# EasyEDA Pro project ProPrj_CGM_BH66F2452_HT32F67595_V1.0.epro

# Schematic CGM_BH66F2452_HT32F67595
Board Name: Board1; Create Date: 2025-03-17; Page Name: P1; Project Name: CGM_BH66F2452_HT32F67595; Schematic Name: CGM_BH66F2452_HT32F67595; Update Date: 2025-05-27; Company: BestHealth; Drawed: viking; Page Size: A4; Version: V1.0
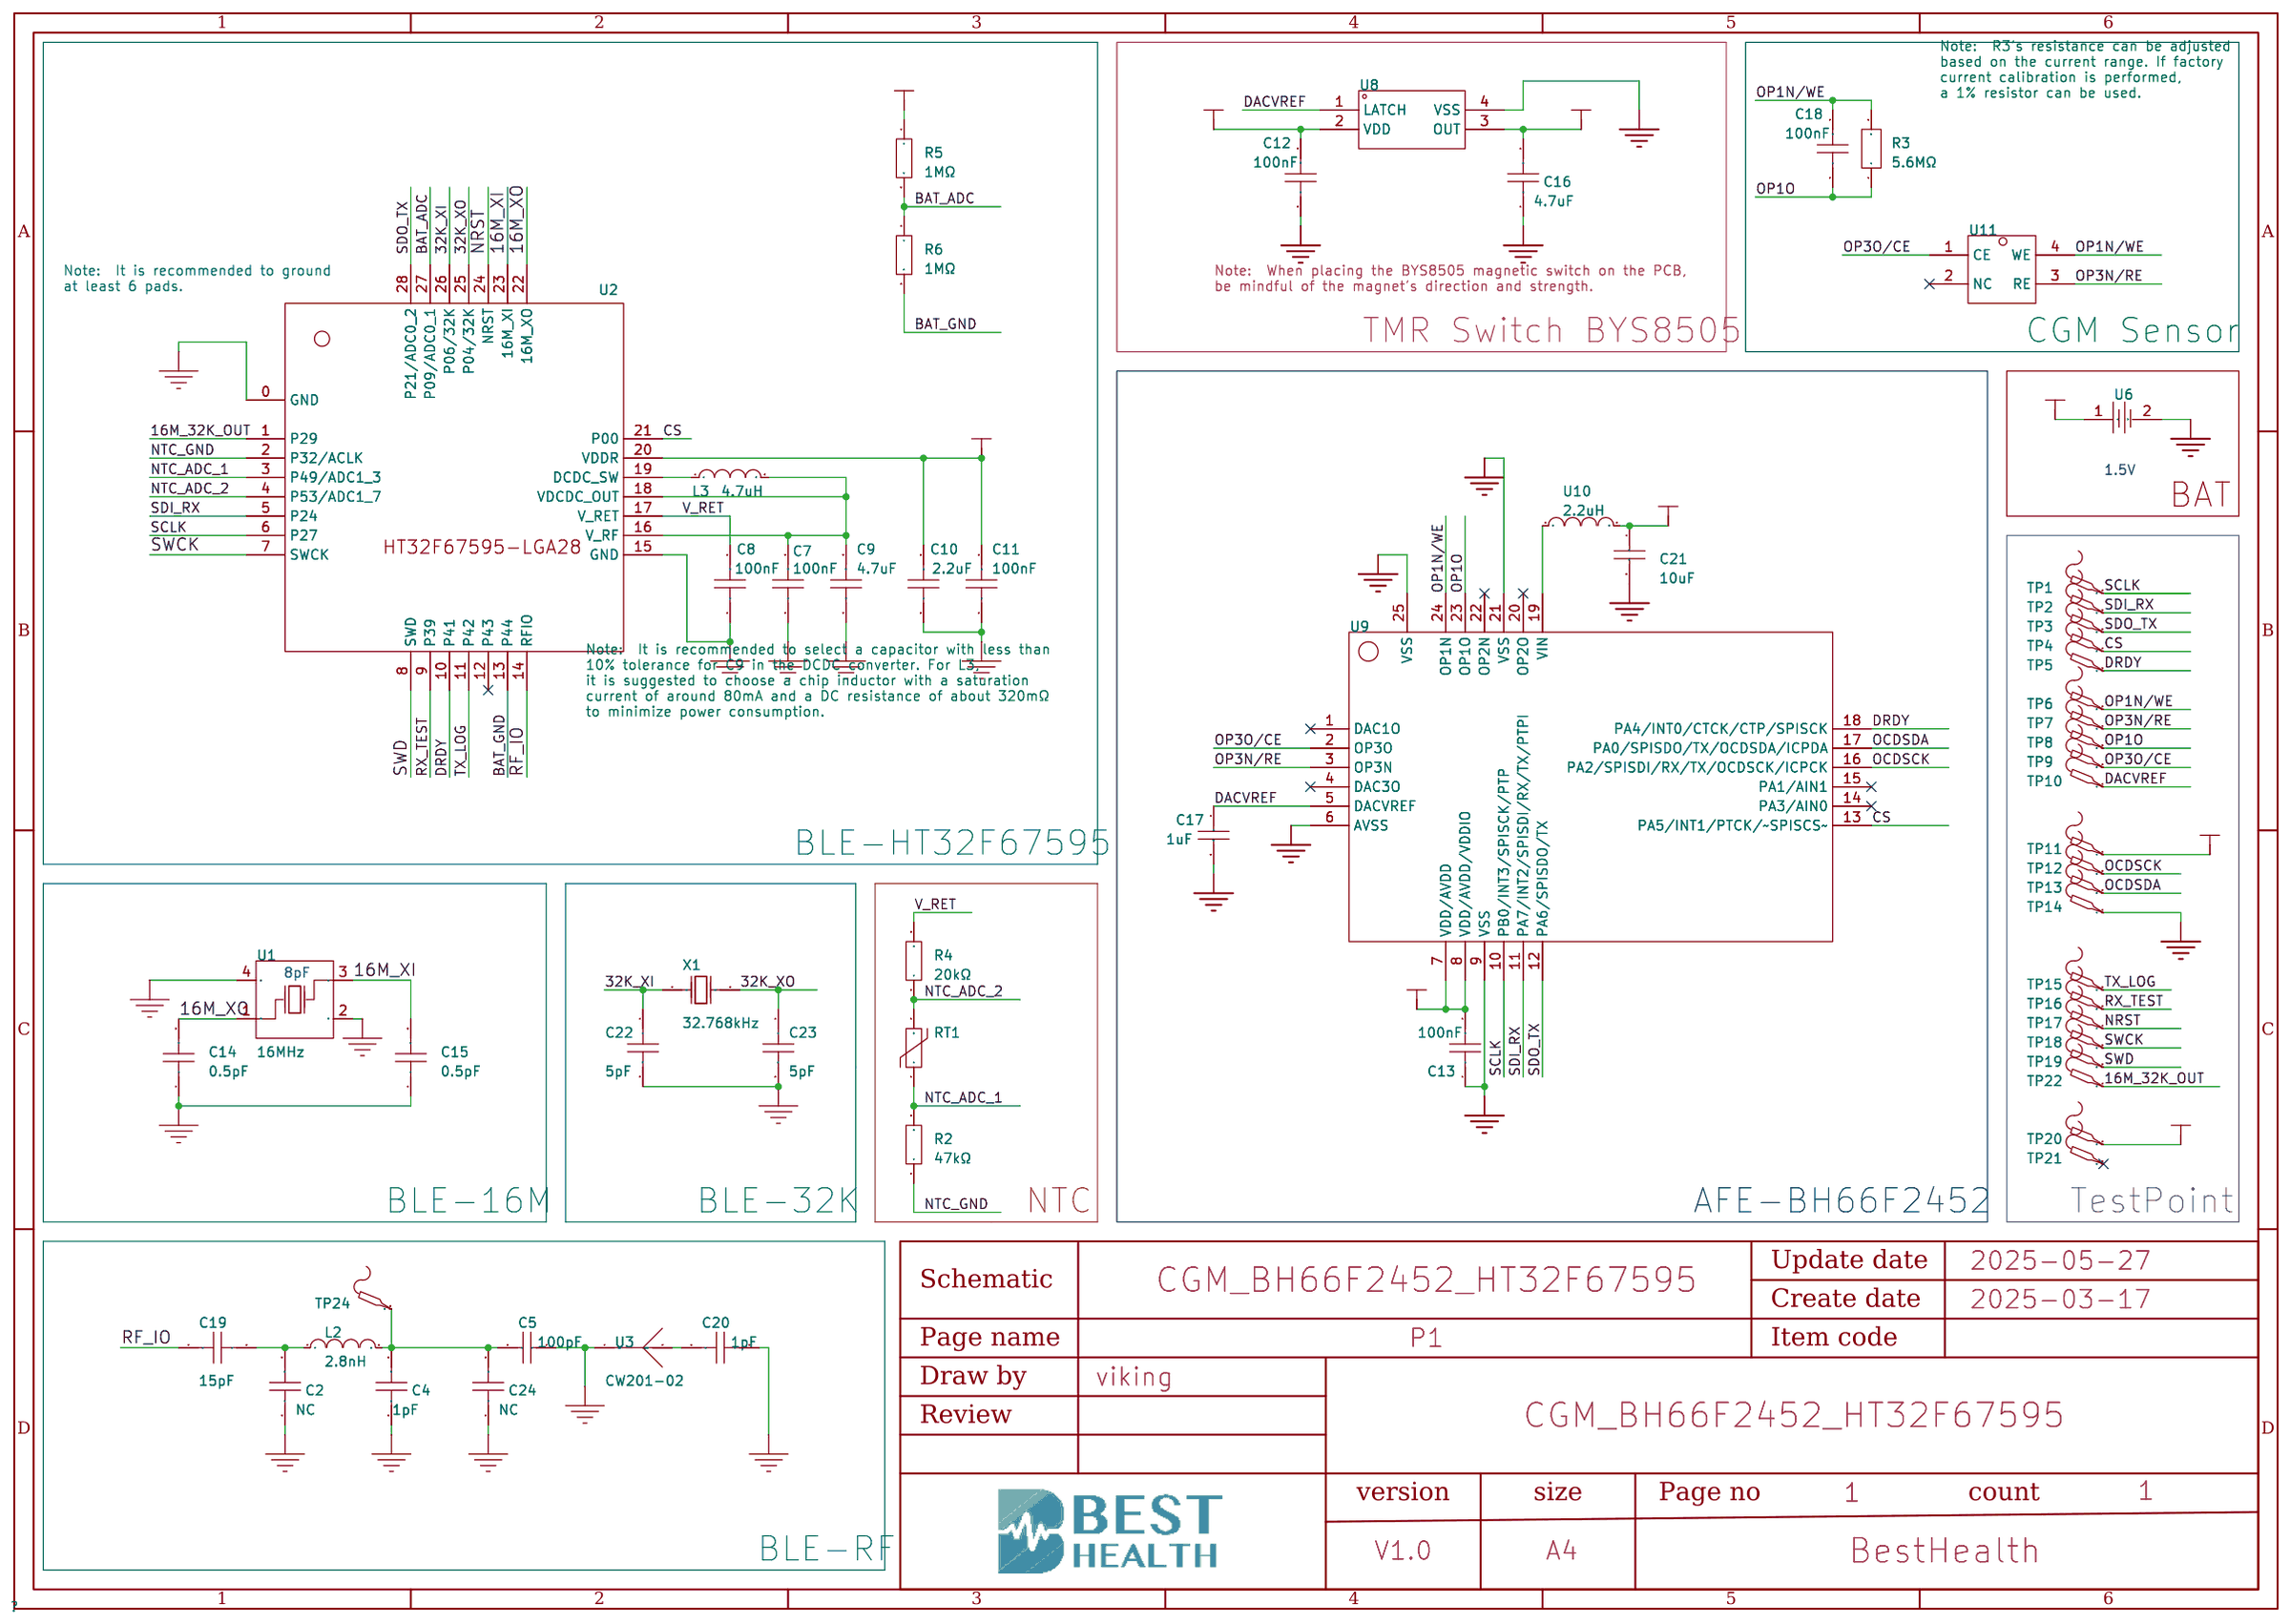
[diagram p0: schematic sheet]

## Parts
C2  1.2pF  [C0201]
C4  1pF  [C0201]
C5  100pF  [C0201]
C7  100nF  [C0201]
C8  100nF  [C0201]
C9  4.7uF  [C0402]
C10  2.2uF  [C0201]
C11  100nF  [C0201]
C12  100nF  [C0201]
C13  100nF  [C0201]
C14  0.5pF  [C0201]  (no BOM)
C15  0.5pF  [C0201]  (no BOM)
C16  4.7uF  [C0201]
C17  1uF  [C0201]
C18  100nF  [C0201]
C19  15pF  [C0201]
C20  1pF  [C0201]
C21  10uF  [C0402]
C22  5pF  [C0201]  (no BOM)
C23  5pF  [C0201]  (no BOM)
C24  1.2pF  [C0201]
L2  2.8nH  [L0201-RD]
L3  4.7uH  [L0603]
R2  47kΩ  [R0201]
R3  5.6MΩ  [R0402]
R4  20kΩ  [R0201]
R5  1MΩ  [R0201]
R6  1MΩ  [R0201]
RT1  NTCG064BF473FTBX  [R0201]
TP1  TP1  [TESTPOINT_1]  (no BOM)
TP2  TP1  [TESTPOINT_1]  (no BOM)
TP3  TP1  [TESTPOINT_1]  (no BOM)
TP4  TP1  [TESTPOINT_1]  (no BOM)
TP5  TP1  [TESTPOINT_1]  (no BOM)
TP6  TP1  [TESTPOINT_1]  (no BOM)
TP7  TP1  [TESTPOINT_1]  (no BOM)
TP8  TP1  [TESTPOINT_1]  (no BOM)
TP9  TP1  [TESTPOINT_1]  (no BOM)
TP10  TP1  [TESTPOINT_1]  (no BOM)
TP11  TP1  [TESTPOINT_1]  (no BOM)
TP12  TP1  [TESTPOINT_1]  (no BOM)
TP13  TP1  [TESTPOINT_1]  (no BOM)
TP14  TP1  [TESTPOINT_1]  (no BOM)
TP15  -  [TESTPOINT_1]  (no BOM)
TP16  -  [TESTPOINT_1]  (no BOM)
TP17  -  [TESTPOINT_1]  (no BOM)
TP18  -  [TESTPOINT_1]  (no BOM)
TP19  -  [TESTPOINT_1]  (no BOM)
TP20  -  [TESTPOINT_1]  (no BOM)
TP21  -  [TESTPOINT_1]  (no BOM)
TP22  -  [TESTPOINT_1]  (no BOM)
TP24  -  [TESTPOINT_1]  (no BOM)
U1  16MHz  [CRYSTAL-SMD_4P-L2.0-W1.6-BL-A]
U2  HT32F67595_LGA28  [LGA28_L3.0_W3.0mm]
U3  CW201-02  [ANT-SMD_L2.0-W1.2_CW201]
U6  -  [SR716]
U8  -  [LGA-4_L1.5-W1.5-P0.65-BL]
U9  -  [WQFN-24_L3.0-W3.0-P0.40-TL-EP1.9]
U10  2.2uH  [IND-SMD_L2.0-W1.6]
U11  -  [CGM_Sener_V2_TBJ]
X1  32.768kHz  [CRYSTAL-SMD_L1.7-W1.1]

## Library data of the parts
C2 C24 = GJM0335C1H1R2WB01D: 容值:1.2pF;额定电压:50V;材质(温度系数):C0G;; LCSC Part Name: 1.2pF 50V; Supplier Part: C1864231; Manufacturer: muRata(村田); Supplier Footprint: 0201; JLCPCB Part Class: 扩展库; Datasheet: https://atta.szlcsc.com/upload/public/pdf/source/20210503/69FEFD345367A6ED6565135E0189A381.pdf; Supplier: LCSC; Voltage Rated: 50V; Temperature Coefficient: C0G
C4 C20 = GRM0335C1H1R0BA01D: 容值:1pF;精度:-;额定电压:50V;材质(温度系数):C0G;; LCSC Part Name: 1pF 50V; Supplier Part: C85893; Manufacturer: muRata(村田); Supplier Footprint: 0201; JLCPCB Part Class: 扩展库; Datasheet: https://atta.szlcsc.com/upload/public/pdf/source/20200305/C490387_23319AE8C154DEB24C505E6C82A8106A.pdf; Supplier: LCSC; Voltage Rated: 50V; Temperature Coefficient: C0G
C5 = GRM0335C1H101JA01D: 容值:100pF;精度:±5%;额定电压:50V;材质(温度系数):C0G;; LCSC Part Name: 100pF ±5% 50V; Supplier Part: C76922; Manufacturer: muRata(村田); Supplier Footprint: 0201; JLCPCB Part Class: 扩展库; Datasheet: https://atta.szlcsc.com/upload/public/pdf/source/20180307/C76922_15204090884891407712.pdf; Supplier: LCSC; Tolerance: ±5%; Voltage Rated: 50V; Temperature Coefficient: C0G
C7 C8 C11-C13 C18 = CL03A104KO3NNNC: 容值:100nF;精度:±10%;额定电压:16V;材质(温度系数):X5R;; LCSC Part Name: 100nF ±10% 16V; Supplier Part: C307380; Manufacturer: SAMSUNG(三星); Supplier Footprint: 0201; JLCPCB Part Class: 扩展库; Datasheet: https://atta.szlcsc.com/upload/public/pdf/source/20181009/C307380_E0679AAF9658ADA26DBF30CED0CA6925.pdf; Supplier: LCSC; Tolerance: ±10%; Voltage Rated: 16V; Temperature Coefficient: X5R
C9 = CL05A475KP5NRNC: 容值:4.7uF;精度:±10%;额定电压:10V;材质(温度系数):X5R;; LCSC Part Name: 4.7uF±10%10V; Supplier Part: C368809; Manufacturer: SAMSUNG(三星); Supplier Footprint: 0402; JLCPCB Part Class: ExtendedPart; Datasheet: https://atta.szlcsc.com/upload/public/pdf/source/20190214/C368809_F5BC89A17870A6A4D09EEE17ED063906.pdf; Supplier: LCSC; Tolerance: ±10%; Voltage Rated: 10V; Temperature Coefficient: X5R
C10 = GRM033R61A225ME47D: 容值:2.2uF;精度:±20%;额定电压:10V;材质(温度系数):X5R;; LCSC Part Name: 2.2uF ±20% 10V; Supplier Part: C319184; Manufacturer: muRata(村田); Supplier Footprint: 0201; JLCPCB Part Class: 扩展库; Datasheet: https://atta.szlcsc.com/upload/public/pdf/source/20181029/C319184_E8D08B09A5B8275146DCCD460C2C3E2F.pdf; Supplier: LCSC; Tolerance: ±20%; Voltage Rated: 10V; Temperature Coefficient: X5R
C14 C15 = GRM0335C1HR50BA01D: 容值:0.5pF;额定电压:50V;温度系数:C0G;; LCSC Part Name: ±0.1pF 0.5pF 50V; Supplier Part: C85920; Manufacturer: muRata(村田); Supplier Footprint: 0201; Datasheet: https://atta.szlcsc.com/upload/public/pdf/source/20200305/C490387_23319AE8C154DEB24C505E6C82A8106A.pdf; Supplier: LCSC; Voltage Rating: 50V; Temperature Coefficient: C0G
C16 = GRM035R60J475ME15D: 容值:4.7uF;精度:±20%;额定电压:6.3V;材质(温度系数):X5R;; LCSC Part Name: 4.7uF ±20% 6.3V; Supplier Part: C335103; Manufacturer: muRata(村田); Supplier Footprint: 0201; JLCPCB Part Class: 扩展库; Datasheet: https://atta.szlcsc.com/upload/public/pdf/source/20181123/C335103_65BC12EC0C1BBB7D605A3646AEC2CDDD.pdf; Supplier: LCSC; Tolerance: ±20%; Voltage Rated: 6.3V; Temperature Coefficient: X5R
C17 = CL03A105MQ3CSNH: 容值:1uF;精度:±20%;额定电压:6.3V;材质(温度系数):X5R;; LCSC Part Name: 1uF ±20% 6.3V; Supplier Part: C53067; Manufacturer: SAMSUNG(三星); Supplier Footprint: 0201; JLCPCB Part Class: 扩展库; Datasheet: https://atta.szlcsc.com/upload/public/pdf/source/20160218/1457707763339.pdf; Supplier: LCSC; Tolerance: ±20%; Voltage Rated: 6.3V; Temperature Coefficient: X5R
C19 = GRM0335C1H150JA01D: 容值:15pF;精度:±5%;额定电压:50V;温度系数:C0G;; LCSC Part Name: 15pF ±5% 50V; Supplier Part: C85891; Manufacturer: muRata(村田); Supplier Footprint: 0201; JLCPCB Part Class: 扩展库; Datasheet: https://atta.szlcsc.com/upload/public/pdf/source/20200305/C490387_23319AE8C154DEB24C505E6C82A8106A.pdf; Supplier: LCSC; Tolerance: ±5%; Voltage Rating: 50V; Temperature Coefficient: C0G
C21 = CL05A106MQ5NUNC: 容值:10uF;精度:±20%;额定电压:6.3V;材质(温度系数):X5R;; LCSC Part Name: 10uF ±20% 6.3V; Supplier Part: C15525; Manufacturer: SAMSUNG(三星); Supplier Footprint: 0402; JLCPCB Part Class: 基础库; Datasheet: https://atta.szlcsc.com/upload/public/pdf/source/20220823/2B02EE04F8F211D38A52DCB16EB6BEBA.pdf; Supplier: LCSC; Tolerance: ±20%; Voltage Rated: 6.3V; Temperature Coefficient: X5R
C22 C23 = GJM0335C1E5R0BB01D: 容值:5pF;额定电压:25V;材质(温度系数):C0G;; LCSC Part Name: 5pF 25V; Supplier Part: C464954; Manufacturer: muRata(村田); Supplier Footprint: 0201; JLCPCB Part Class: 扩展库; Datasheet: https://atta.szlcsc.com/upload/public/pdf/source/20191129/C464954_5BF7E89BC2BFACC5C6B733268D26AC03.pdf; Supplier: LCSC; Voltage Rated: 25V; Temperature Coefficient: C0G
L2 = LQP03TG2N8B02D: 电感值:2.8nH;精度:-;额定电流:450mA;饱和电流(Isat):-;直流电阻(DCR):250mΩ;; Supplier Part: C237463; Manufacturer: muRata(村田); Supplier Footprint: 0201; Datasheet: https://atta.szlcsc.com/upload/public/pdf/source/20181120/C333991_3B037B5A0300CC3F313E5A09B9D1E037.pdf; Supplier: LCSC; Rated Current: 450mA; DC Resistance (DCR): 250mΩ; Q @ Freq: 13@500MHz; Frequency - Self Resonant: 6GHz; Type: 厚膜电感
L3 = MLZ1608N4R7LT000: 电感值:4.7uH;精度:±20%;额定电流:-;饱和电流(Isat):80mA;直流电阻(DCR):320mΩ;; LCSC Part Name: 4.7uH ±20% 80mA; Supplier Part: C383396; Manufacturer: TDK; Supplier Footprint: 0603; JLCPCB Part Class: 扩展库; Datasheet: https://atta.szlcsc.com/upload/public/pdf/source/20200619/C383390_12B08DE970320BE328D08C37492510E7.pdf; Supplier: LCSC; Tolerance: ±20%; Saturation Current (Isat): 80mA; DC Resistance (DCR): 320mΩ; Frequency - Self Resonant: 80MHz
R2 = RC0201FR-0747KL: 电阻类型:厚膜电阻;阻值:47kΩ;精度:±1%;功率:50mW;温度系数:±200ppm/℃;最大工作电压:25V;工作温度范围:-55℃~+155℃;; LCSC Part Name: 47kΩ ±1% 50mW; Supplier Part: C138139; Manufacturer: YAGEO(国巨); Supplier Footprint: 0201; JLCPCB Part Class: 扩展库; Datasheet: https://atta.szlcsc.com/upload/public/pdf/source/20171107/C138139_15100517155931097035.pdf; Supplier: LCSC; Type: 厚膜电阻; Tolerance: ±1%; Power(Watts): 50mW; Temperature Coefficient: ±200ppm/℃; Overload Voltage (Max): 25V; Operating Temperature Range: -55℃~+155℃
R3 = RC0402FR-075M6L: 电阻类型:厚膜电阻;阻值:5.6MΩ;精度:±1%;功率:62.5mW;最大工作电压:50V;温度系数:±100ppm/℃;; LCSC Part Name: 厚膜电阻 5.6MΩ ±1% 62.5mW; Supplier Part: C477755; Manufacturer: YAGEO(国巨); Supplier Footprint: 0402; JLCPCB Part Class: 扩展库; Datasheet: https://atta.szlcsc.com/upload/public/pdf/source/20200715/C477755_2FF05B608096128DB9D1572F7AA4D559.pdf; Supplier: LCSC; Type: 厚膜电阻; Tolerance: ±1%; Power(Watts): 62.5mW; Overload Voltage (Max): 50V; Temperature Coefficient: ±100ppm/℃; Operating Temperature Range: -55℃~+155℃
R4 = RC0201FR-0720KL: 电阻类型:厚膜电阻;阻值:20kΩ;精度:±1%;功率:50mW;最大工作电压:25V;温度系数:±200ppm/℃;; LCSC Part Name: 厚膜电阻 20kΩ ±1% 50mW; Supplier Part: C295787; Manufacturer: YAGEO(国巨); Supplier Footprint: 0201; JLCPCB Part Class: 扩展库; Datasheet: https://atta.szlcsc.com/upload/public/pdf/source/20181009/C309620_DA5935B6E1D48212CB7A533FE518B3C2.pdf; Supplier: LCSC; Type: 厚膜电阻; Tolerance: ±1%; Power(Watts): 50mW; Overload Voltage (Max): 25V; Temperature Coefficient: ±200ppm/℃; Operating Temperature Range: -55℃~+125℃
R5 R6 = RC0201FR-071ML: 电阻类型:厚膜电阻;阻值:1MΩ;精度:±1%;功率:50mW;最大工作电压:25V;温度系数:±200ppm/℃;; LCSC Part Name: 厚膜电阻 1MΩ ±1% 50mW; Supplier Part: C295786; Manufacturer: YAGEO(国巨); Supplier Footprint: 0201; JLCPCB Part Class: 扩展库; Datasheet: https://atta.szlcsc.com/upload/public/pdf/source/20181009/C309620_DA5935B6E1D48212CB7A533FE518B3C2.pdf; Supplier: LCSC; Type: 厚膜电阻; Tolerance: ±1%; Power(Watts): 50mW; Overload Voltage (Max): 25V; Temperature Coefficient: ±200ppm/℃; Operating Temperature Range: -55℃~+125℃
RT1 = NTCG064BF473FTBX: 阻值(25℃):47kΩ;电阻精度:±1%;B值精度:±1%;B值(25℃/50℃):4050K;功率:100mW;最大稳态电流(25℃):140uA;; LCSC Part Name: 47kΩ 电阻精度:±1% 4050K; Supplier Part: C387869; Manufacturer: TDK; Supplier Footprint: 0201; JLCPCB Part Class: 扩展库; Datasheet: https://atta.szlcsc.com/upload/public/pdf/source/20190412/C387869_7488A33476C163DAFB157DE1B3701229.pdf; Supplier: LCSC; Resistance @ 25℃: 47kΩ; Resistance Tolerance: ±1%; B Constant Tolerance: ±1%; B Constant (25℃/50℃): 4050K; Power: 100mW; Steady State Current (Max): 140uA; B Constant (25℃/75℃): 4098K; B Constant (25℃/85℃): 4114K; B Constant (25℃/100℃): 4137K; Operating Temperature: -40℃~+125℃
TP1-TP22 TP24 = Test-Point: Test Point 测试点
U1 = XL7EL89CKI-111YLC-16M: 频率:16MHz;负载电容:8pF;频率公差:±10ppm;; LCSC Part Name: 16MHz ±10ppm 8pF YSX211SL; Supplier Part: C2965577; Manufacturer: YXC(扬兴晶振); Supplier Footprint: SMD2016-4P; Datasheet: https://atta.szlcsc.com/upload/public/pdf/source/20220121/6B4B3E7EF7974858943D806BF8CACEA3.pdf; Supplier: LCSC; Crystal Type: 贴片无源晶振; Load Capacitance: 8pF; Frequency Tolerance: ±10ppm; Frequency Stability: ±20ppm; Operating Temperature: -40℃~+85℃
U2 = HT32F67595_LGA28: Check: true
U3 = CW201-02: LCSC Part Name: LXC(连兴创)陶瓷SMT天线-CW201; Supplier Part: C42379496; Manufacturer: LXC(连兴创); JLCPCB Part Class: 扩展库; Datasheet: https://atta.szlcsc.com/upload/public/pdf/source/20241122/D5EBC13B9CDD4B62BA2D0887DE2C1252.pdf; Supplier: LCSC
U6 = SR716: 氧化銀紐扣電池1.5V
U8 = BYS8505
U9 = BH66F2452: 该单片机是一款 A/D 型具有 8 位高性能精简指令集的 Flash 单片机，内置连续 / 血糖监测 AFE 模块，专门为连续血糖监测产品而设计。; Manufacturer: HOLTEK
U10 = VLS201610CX-2R2M-1: 电感值:2.2uH;精度:±20%;额定电流:1.31A;饱和电流(Isat):1.31A;; LCSC Part Name: 2.2uH ±20% 1.31A; Supplier Part: C2041554; Manufacturer: TDK; Supplier Footprint: 0806; JLCPCB Part Class: 扩展库; Datasheet: https://atta.szlcsc.com/upload/public/pdf/source/20210607/29FFFE08DAA36C14F0381340FA7171C4.pdf; Supplier: LCSC; Tolerance: ±20%; Rated Current: 1.31A; Saturation Current (Isat): 1.31A; DC Resistance (DCR): 136mΩ
U11 = CGM_Sensor_V2_TBJ
X1 = X1A0001210005_C5154201: 频率:32.768kHz;外接负载电容:12.5pF;; LCSC Part Name: 32.768kHz 12.5pF; Supplier Part: C5154201; Manufacturer: EPSON(爱普生); Manufacturer Part: X1A0001210005; Supplier Footprint: SMD1610-2P; Datasheet: https://atta.szlcsc.com/upload/public/pdf/source/20220902/8E45647E0861F7DDF8A395DB16B8FC1E.pdf; Supplier: LCSC; External load capacitor: 12.5pF

## Nets
GND: C2.1 C4.1 C5.2 C7.1 C8.1 C9.1 C10.1 C11.1 C12.1 C13.1 C14.1 C15.1 C16.1 C17.2 C20.1 C21.2 C22.2 C23.2 C24.1 TP14.1 U1.2(GND) U1.4(GND) U2.0(GND) U2.15(GND) U3.1(Signal Input) U6.2 U8.4(VSS) U9.6(AVSS) U9.9(VSS) U9.21(VSS) U9.25(VSS)
VBAT: C12.2 R5.1 TP20.1 U6.1 U8.2(VDD)
VBATO: C16.2 C21.1 U8.3(OUT) U10.2
VDD: C10.2 C11.2 C13.2 TP11.1 U2.20(VDDR) U9.7(VDD/AVDD) U9.8(VDD/AVDD/VDDIO)
16M_32K_OUT: TP22.1 U2.1(P29)
16M_XI: C15.2 U1.3(OSC2) U2.23(16M_XI)
16M_XO: C14.2 U1.1(OSC1) U2.22(16M_XO)
32K_XI: C22.1 U2.26(P06/32K) X1.1(OSC1)
32K_XO: C23.1 U2.25(P04/32K) X1.2(OSC2)
BAT_ADC: R5.2 R6.1 U2.27(P09/ADC0_1)
BAT_GND: R6.2 U2.13(P44)
CS: TP4.1 U2.21(P00) U9.13(PA5/INT1/PTCK/~SPISCS~)
DACVREF: C17.1 TP10.1 U8.1(LATCH) U9.5(DACVREF)
DRDY: TP5.1 U2.10(P41) U9.18(PA4/INT0/CTCK/CTP/SPISCK)
NRST: TP17.1 U2.24(NRST)
NTC_ADC_1: R2.2 RT1.1 U2.3(P49/ADC1)
NTC_ADC_2: R4.1 RT1.2 U2.4(P53/ADC1_7)
NTC_GND: R2.1 U2.2(P32/ACLK)
OCDSCK: TP12.1 U9.16(PA2/SPISDI/RX/TX/OCDSCK/ICPCK)
OCDSDA: TP13.1 U9.17(PA0/SPISDO/TX/OCDSDA/ICPDA)
OP1N/WE: C18.2 R3.2 TP6.1 U9.24(OP1N) U11.4(WE)
OP1O: C18.1 R3.1 TP8.1 U9.23(OP1O)
OP3N/RE: TP7.1 U9.3(OP3N) U11.3(RE)
OP3O/CE: TP9.1 U9.2(OP3O) U11.1(CE)
RF_IO: C19.1 U2.14(RFIO)
RX_TEST: TP16.1 U2.9(P39)
SCLK: TP1.1 U2.6(P27) U9.10(PB0/INT3/SPISCK/PTP)
SDI_RX: TP2.1 U2.5(P24) U9.11(PA7/INT2/SPISDI/RX/TX/PTPI)
SDO_TX: TP3.1 U2.28(P21/ADC0_2) U9.12(PA6/SPISDO/TX)
SWCK: TP18.1 U2.7(SWCK)
SWD: TP19.1 U2.8(SWD)
TX_LOG: TP15.1 U2.11(P42)
V_RET: C8.2 R4.2 U2.17(V_RET)
$1N117316: L3.1 U2.19(DCDC_SW)
$1N117351: C7.2 C9.2 L3.2 U2.16(V_RF) U2.18(VDCDC_OUT)
$1N176146: U9.19(VIN) U10.1
$1N182514: C4.2 C5.1 C24.2 L2.2 TP24.1
$1N182522: C20.2 U3.2(Tuning/Signal Output)
$1N182523: C2.2 C19.2 L2.1

Not connected (* = marked no-connect by the designer): TP21 1*; U2 12(P43)*; U9 1(DAC1O)* 4(DAC3O)* 14(PA3/AIN0)* 15(PA1/AIN1)* 20(OP2O)* 22(OP2N)*; U11 2(NC)*

## Notes on the sheet
- Note:  R3's resistance can be adjusted
  based on the current range. If factory
  current calibration is performed,
  a 1% resistor can be used.
- Note:  It is recommended to ground
  at least 6 pads.
- Note:  When placing the BYS8505 magnetic switch on the PCB,
  be mindful of the magnet's direction and strength.
- TMR Switch BYS8505
- CGM Sensor
- 1.5V
- BAT
- Note:  It is recommended to select a capacitor with less than
  10% tolerance for C9 in the DCDC converter. For L3,
  it is suggested to choose a chip inductor with a saturation
  current of around 80mA and a DC resistance of about 320mΩ
  to minimize power consumption.
- BLE-HT32F67595
- 8pF
- BLE-16M
- BLE-32K
- NTC
- AFE-BH66F2452
- TestPoint
- BLE-RF

# Board CGM_BH66F2452_HT32F67595
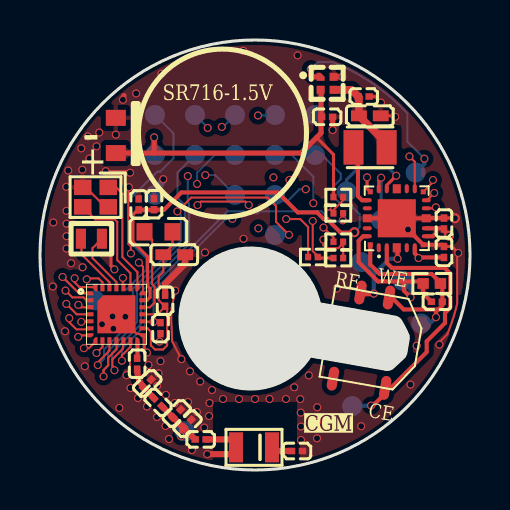
[diagram p1: board, top side]
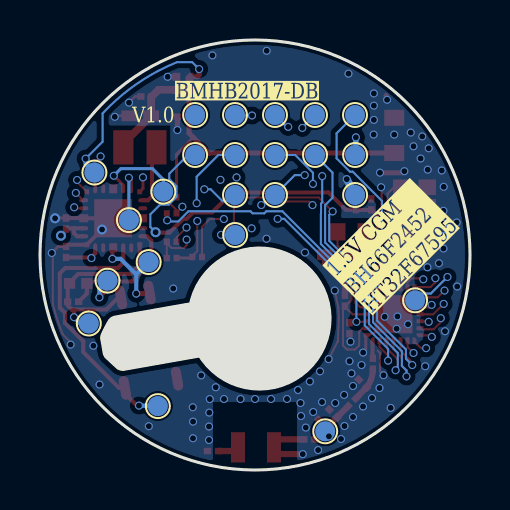
[diagram p2: board, bottom side, seen from below]

Outline 21.5 x 21.5 mm; copper layers: Top Layer, Inner1, Inner2, Bottom Layer. Coordinates in mm from the lower left corner of the outline.
Outline path: circle c10.75,10.75 r10.75
Stack: Top Layer 0.035mm 外层铜厚1oz / Dielectric1 0.2133mm 7628 RC49% 8.6mil / Inner1 0.035mm 内层铜厚 / Dielectric2 0.2133mm 1.1mm H/HOZ Copper / Inner2 0.035mm 内层铜厚 / Dielectric3 0.2133mm 7628 RC49% 8.6mil / Bottom Layer 0.035mm 外层铜厚1oz

## Design rules (mm)
net 16M_XI: DP2
net 16M_XO: DP2
net 32K_XO: DP1
net 32K_XI: DP1
template: 自定义配置
spacing copperThickness1oz (default): track to track 0.102, other pairs 0.102 to 0.3
spacing copperThickness2oz: track to track 0.203, other pairs 0.152 to 0.3
spacing copperThicknessInner0.5oz: track to track 0.089, other pairs 0.152 to 0.3
track width copperThickness1oz (default): min 0.102, default 0.254, max 2.54
track width copperThickness2oz: min 0.203, default 0.254, max 2.54
track width copperThickness0.5oz: min 0.089, default 0.254, max 2.54
differential pair differentialPair (default): width min 0.102, default 0.254, max 2.54; gap min 0.152, default 0.152
via viaSize (default): diameter min 0.3, default 0.61, max 10; hole min 0.201, default 0.305, max 6.299

## Placement (name value [footprint] x y rotation side)
C2  1.2pF  [C0201]  5.37 4.32 225 top
C4  1pF  [C0201]  6.84 2.83 225 top
C5  100pF  [C0201]  8.03 1.53 0 top
C7  100nF  [C0201]  6.25 8.46 270 top
C8  100nF  [C0201]  6.03 7.09 90 top
C9  4.7uF  [C0402]  6.71 10.77 180 top
C10  2.2uF  [C0201]  4.93 13.28 270 top
C11  100nF  [C0201]  5.7 13.29 270 top
C12  100nF  [C0201]  14.36 17.66 180 top
C13  100nF  [C0201]  20.2 12.33 270 top
C16  4.7uF  [C0201]  16.19 18.67 180 top
C17  1uF  [C0201]  20.2 10.9 90 top
C18  100nF  [C0201]  19.84 8.41 0 top
C19  15pF  [C0201]  4.86 5.31 270 top
C20  1pF  [C0201]  12.85 0.95 180 top
C21  10uF  [C0402]  16.49 17.71 0 top
C24  1.2pF  [C0201]  7.37 2.32 225 top
L2  2.8nH  [L0201-RD]  5.9 3.38 315 top
L3  4.7uH  [L0603]  5.92 11.91 0 top
R2  47kΩ  [R0201]  14.92 11.41 0 top
R3  5.6MΩ  [R0402]  19.59 9.33 0 top
R4  20kΩ  [R0201]  13.65 10.65 180 top
R5  1MΩ  [R0201]  14.92 13.65 0 top
R6  1MΩ  [R0201]  14.92 12.83 0 top
RT1  NTCG064BF473FTBX  [R0201]  14.92 10.6 180 top
TP1  TP1  [TESTPOINT_1]  11.75 13.75 0 bottom
TP2  TP1  [TESTPOINT_1]  9.75 13.75 0 bottom
TP3  TP1  [TESTPOINT_1]  11.75 15.75 0 bottom
TP4  TP1  [TESTPOINT_1]  9.75 15.75 0 bottom
TP5  TP1  [TESTPOINT_1]  11.75 11.75 0 bottom
TP6  TP1  [TESTPOINT_1]  19.06 7.32 0 bottom
TP7  TP1  [TESTPOINT_1]  16.07 10.4 0 bottom
TP8  TP1  [TESTPOINT_1]  18.13 9.47 0 bottom
TP9  TP1  [TESTPOINT_1]  15.61 3.19 0 bottom
TP10  TP1  [TESTPOINT_1]  18.78 14.87 0 bottom
TP11  TP1  [TESTPOINT_1]  13.75 15.75 0 bottom
TP12  TP1  [TESTPOINT_1]  15.33 13.92 0 bottom
TP13  TP1  [TESTPOINT_1]  17.05 12.49 0 bottom
TP14  TP1  [TESTPOINT_1]  5.75 13.75 0 bottom
TP15  -  [TESTPOINT_1]  7.75 15.75 0 bottom
TP16  -  [TESTPOINT_1]  11.75 17.75 0 bottom
TP17  -  [TESTPOINT_1]  5.75 17.75 0 bottom
TP18  -  [TESTPOINT_1]  7.75 17.75 0 bottom
TP19  -  [TESTPOINT_1]  9.75 17.75 0 bottom
TP20  -  [TESTPOINT_1]  5.75 15.75 0 bottom
TP21  -  [TESTPOINT_1]  13.75 17.75 0 bottom
TP22  -  [TESTPOINT_1]  2.75 8.48 180 bottom
TP24  -  [TESTPOINT_1]  7.24 1.94 180 bottom
U1  16MHz  [CRYSTAL-SMD_4P-L2.0-W1.6-BL-A]  2.77 13.65 180 top
U2  HT32F67595_LGA28  [LGA28_L3.0_W3.0mm]  3.82 7.79 0 top
U3  CW201-02  [ANT-SMD_L2.0-W1.2_CW201]  10.7 1.13 0 top
U6  -  [SR716]  9.12 16.85 90 top
U8  -  [LGA-4_L1.5-W1.5-P0.65-BL]  14.36 19.33 270 top
U9  -  [WQFN-24_L3.0-W3.0-P0.40-TL-EP1.9]  17.84 12.59 90 top
U10  2.2uH  [IND-SMD_L2.0-W1.6]  16.5 16.13 180 top
U11  -  [CGM_Sener_V2_TBJ]  17.45 8.62 170 top
X1  32.768kHz  [CRYSTAL-SMD_L1.7-W1.1]  2.57 11.56 0 top

## Footprints (pads in the part's own frame, mm; a bottom-side part is the same pattern mirrored in y, then rotated)
ANT-SMD_L2.0-W1.2_CW201
  rect 0.7x1.5 smd: 1(-0.9,-0.001) 2(0.9,0.001)
C0201
  rect 0.368x0.324 smd: 1(-0.275,0) 2(0.275,0)
C0402
  rect 0.79x0.54 smd: 1(-0.545,0) 2(0.545,0)
CGM_Sener_V2_TBJ
  oval 0.5x1.2 smd: 1(-0.595,4.482) 2(2.055,4.482) 3(1.45,0) 4(0,0)
CRYSTAL-SMD_4P-L2.0-W1.6-BL-A
  rect 0.875x0.775 smd: 1(-0.638,-0.488) 2(0.638,-0.488) 3(0.638,0.488) 4(-0.638,0.488)
CRYSTAL-SMD_L1.7-W1.1
  rect 0.5x1 smd: 1(-0.525,0) 2(0.525,0)
IND-SMD_L2.0-W1.6
  rect 1x1.72 smd: 1(0.828,0) 2(-0.828,0)
L0201-RD
  rect 0.368x0.324 smd: 1(-0.275,0) 2(0.275,0)
L0603
  rect 0.8x0.864 smd: 1(-0.7,0) 2(0.7,0)
LGA28_L3.0_W3.0mm
  custom 1.9x1.9 smd: 0(0,0)
  custom 0.35x0.2 smd: 1(-1.375,1.05) 7(-1.375,-1.05) 15(1.375,-1.05) 21(1.375,1.05)
  rect 0.35x0.2 smd: 2(-1.325,0.7) 3(-1.325,0.35) 4(-1.325,0) 5(-1.325,-0.35) 6(-1.325,-0.7) 16(1.325,-0.7) 17(1.325,-0.35) 18(1.325,0) 19(1.325,0.35) 20(1.325,0.7)
  custom 0.2x0.35 smd: 8(-1.05,-1.375) 14(1.05,-1.375) 22(1.05,1.375) 28(-1.05,1.375)
  rect 0.2x0.35 smd: 9(-0.7,-1.325) 10(-0.35,-1.325) 11(0,-1.325) 12(0.35,-1.325) 13(0.7,-1.325) 23(0.7,1.325) 24(0.35,1.325) 25(0,1.325) 26(-0.35,1.325) 27(-0.7,1.325)
LGA-4_L1.5-W1.5-P0.65-BL
  custom 0.4x0.4 smd: 1(-0.325,-0.325)
  rect 0.4x0.4 smd: 2(0.325,-0.325) 3(0.325,0.325) 4(-0.325,0.325)
R0201
  rect 0.303x0.324 smd: 1(-0.241,0) 2(0.241,0)
R0402
  rect 0.566x0.54 smd: 1(-0.433,0) 2(0.433,0)
SR716
  rect 0.8x1 smd: 1(-1,5.334) 2(0.762,5.334)
TESTPOINT_1
  round 1 smd: 1(0,-0.001)
WQFN-24_L3.0-W3.0-P0.40-TL-EP1.9
  oval 0.45x0.2 smd: 1(-1.475,0.9) 2(-1.475,0.5) 4(-1.475,-0.5) 5(-1.475,-0.9) 13(1.475,-0.9) 14(1.475,-0.5) 16(1.475,0.5) 17(1.475,0.9)
  rect 0.45x0.4 smd: 3(-1.475,0) 15(1.475,0)
  rect 0.25x0.25 smd: 6(-1.325,-1.325) 12(1.325,-1.325) 18(1.325,1.325) 24(-1.325,1.325)
  oval 0.2x0.45 smd: 7(-0.9,-1.475) 8(-0.5,-1.475) 10(0.5,-1.475) 11(0.9,-1.475) 19(0.9,1.475) 20(0.5,1.475) 22(-0.5,1.475) 23(-0.9,1.475)
  rect 0.4x0.45 smd: 9(0,-1.475) 21(0,1.475)
  rect 1.9x1.9 smd: 25(0,0)

## Nets
As in the schematic.

Pads without a net: TP21 1; U2 12; U9 1 4 14 15 20 22; U11 2

## Via types
v1: diameter 0.4, hole 0.3, Top Layer to Bottom Layer, 148 vias
v2: diameter 0.5, hole 0.3, Top Layer to Bottom Layer, 4 vias

## Routing (per net, layer and track width the routed paths; a pad name or vN(x,y) marks a point on that pad's centre or on a via; arc(x,y) is an arc through that point)
GND: length 41.5
  Top Layer w0.102: v1(6.76,8.97) 6.58,8.11 6.56,7.6 6.61,6.43 v1(7.07,5.54) ; U1.4 3.26,13.16 2.29,14.13 U1.2 ; v1(19.97,6.27) 19.97,6.39 20.36,6.79 arc(20.57,7.33) 20.75,7.89 arc(20.81,8.1) 20.86,8.31 20.86,10.8 v1(20.91,10.85) ; U2.0 4.82,6.83 U2.15 ; v1(4.44,14.14) 4.42,14.11 4.42,11.31 4.54,11.18 v1(4.54,10.82) ; 5.97,6.82 v1(5.97,6.42) ; v1(4.32,4.74) 4.5,4.92 4.5,5.84 4.62,5.96
  Top Layer w0.127: v1(17.05,18.37) 16.74,18.67 C16.1 ; v1(17.76,17.66) 17.71,17.71 C21.2
  Top Layer w0.152: v1(20.91,10.85) 20.59,11.18 20.2,11.18 ; 20.2,12.6 20.73,12.6 v2(20.75,12.59) ; v1(5.34,5.87) 5.21,6 5.21,6.72 U2.15 ; v1(3.72,10.03) 3.55,10.2 3.55,12.16 3.4,12.3 1.34,12.3 v1(1.33,12.32)
  Top Layer w0.203: U9.25 U9.9 19.33,12.6 20.2,12.6 ; U9.25 v2(18.4,12.03) U9.6 20.11,11.26 20.2,11.18 ; U9.25 U9.21
  Top Layer w0.254: v1(3.28,14.94) 3.36,14.86 v1(4.5,14.86) ; 14.63,17.66 v1(14.63,17) ; U8.4 v1(15.12,19.66) ; 4.2,18.73 arc(4.17,18.68) 4.19,18.63
  Top Layer w0.305: C5.2 9.8,1.53 9.8,0.81 9.78,0.79 v1(8.36,0.79) ; 7.26,10.77 7.26,10.31 6.25,9.3 C7.1
  Bottom Layer w0.381: v1(6.16,14.54) TP14.1
  vias: v1(0.67,12.38) v1(0.64,9.17) v1(1.25,6.94) v1(1.31,14.16) v1(1.33,12.96) v1(1.33,11.69) v1(1.33,11.07) v1(1.41,14.98) v1(1.55,10.34) v1(2.06,16.08) v1(2.11,15.02) v1(2.13,10.14) v1(2.24,5.19) v1(2.39,16.68) v1(2.47,15.58) v1(2.82,16.19) v1(2.96,16.87) v1(3.1,7.29) v1(3.63,7.68) v1(3.67,7.06) v1(3.79,16.77) v1(3.97,3.1) v1(4.15,18.51) v1(4.27,7.66) v1(4.52,4.1) v1(4.81,18.83) v1(4.81,18.22) v1(4.81,17.51) v1(4.82,16.77) v1(4.9,3.6) v1(5.35,3.17) v1(5.42,5.25) v1(5.85,4.2) v1(5.85,2.65) v1(5.93,4.83) v1(6.08,19.82) v1(6.03,5.44) v1(6.29,3.76) v1(6.28,2.2) v1(6.45,1.55) v1(6.74,3.35) v1(7.5,4.93) v1(7.4,3.4) v1(7.6,1) v1(7.84,2.9) v1(8.01,4.43) v1(8.25,10.88) v1(8.21,2.12) v1(8.47,3.35) v1(8.45,2.7) v1(8.6,4) v1(9.15,3.55) v1(9.95,3.55) v1(10.17,20.96) v1(10.17,11.56) v1(10.75,3.55) v1(11.47,3.55) v1(12.3,3.55) v1(12.71,4.14) v1(12.88,20.73) v1(13.01,3.55) v1(13.04,2.87) v1(13.05,2.17) v1(13.05,1.5) v1(13.44,4.73) v1(13.86,3.14) v1(13.85,2.42) v1(13.85,1.59) v1(14.84,9.07) v1(16.06,2.19) v1(18.52,4.27) v1(18.83,6.21)
VBAT: length 17.9
  Top Layer w0.152: R5.1 14.67,15.78 13.83,16.62
  Top Layer w0.254: 5.71,15.85 13.05,15.85 14.05,16.85 14.05,17.63 ; 5.71,15.85 v1(5.71,16.63) ; 5.71,15.85 U6.1 ; 14.05,17.63 14.05,18.99 U8.2 ; 14.05,17.63 C12.2
  Bottom Layer w0.254: v1(5.71,16.63) 5.71,15.79 5.75,15.75
VBATO: length 4.5
  Top Layer w0.381: U8.3 15.58,19.01 15.91,18.67 15.95,18.64 C21.1 17.33,16.32 U10.2
VDD: length 30.4
  Top Layer w0.152: C10.2 4.88,13.01 4.65,12.77 4.65,11.4 5.38,10.67 5.38,9.19 5.5,9.07 5.5,8.64 5.35,8.49 U2.20
  Top Layer w0.203: v2(20.45,11.72) 20.2,11.97 C13.2 20.16,12.09 19.81,12.09 ; C10.2 5.69,13.01 C11.2 6.21,13.02 7.07,13.88 11.89,13.88 12.89,12.88 13.85,12.88 14.18,12.55 14.35,12.55 15.03,11.87 15.7,11.87 v2(15.72,11.89) ; U9.7 19.64,11.69 19.81,11.85 19.81,12.08 19.81,12.09 ; 19.81,12.09 U9.8
  Inner2 w0.203: v2(15.72,11.89) 16.33,12.5 19.66,12.5 v2(20.45,11.72)
  Bottom Layer w0.102: TP11.1 14.1,15.75 15.04,14.81 15.04,14.55 14.68,14.19 14.68,13.65 15.06,13.27 15.5,13.27 15.98,12.78 15.98,12.15 v2(15.72,11.89)
(no net): length 25.8
  Top Layer w0.102: 4.17,6.46 4.15,6.44 4.15,6.07 3.64,5.56 3.64,5.54 3.62,5.52 3.62,5.21 3.72,5.11 v1(3.72,4.99)
  Inner2 w0.102: 16.19,19.08 8.26,19.08 7.39,18.21 v1(7.39,14.69)
  Bottom Layer w0.102: v1(7.39,14.69) 7.39,13.38 7.45,13.32 7.45,12.81 7.46,12.8 7.46,11.3 5.05,8.89 5.05,7.3 3.61,5.86 3.61,5.1 v1(3.72,4.99)
16M_32K_OUT: length 3.8
  Top Layer w0.102: v1(1.13,9.65) 1.94,8.84 U2.1
  Bottom Layer w0.102: v1(1.13,9.65) 1.96,8.82 2.52,8.82 2.74,8.6 2.74,8.48
16M_XI: length 5.6
  Top Layer w0.102: U1.3 2.77,12.53 3.74,12.53 3.86,12.41 3.86,10.5 4.52,9.84 U2.23
16M_XO: length 5.8
  Top Layer w0.102: 4.87,9.16 4.87,9.89 4.12,10.65 4.12,13.82 3.81,14.13 U1.1
32K_XI: length 3.2
  Top Layer w0.102: 2.07,11.76 2.07,10.79 3.47,9.39 U2.26
32K_XO: length 3.1
  Top Layer w0.102: X1.2 2.62,11.09 2.62,10.6 3.82,9.4 U2.25
BAT_ADC: length 17.5
  Top Layer w0.102: U2.27 3.12,9.39 2.93,9.58 2.38,9.58 v1(2.34,9.53) ; 14.67,12.87 14.67,13 15.16,13.48 R5.2 ; 14.67,12.87 R6.1 ; 14.67,12.87 v1(14.38,13.16) ; 3.12,9.08 3.1,9.09
  Inner2 w0.102: v1(2.34,9.53) 3,8.87 4.4,8.87 9.36,13.83 12.83,13.83 13,13.66 13.46,13.66 13.59,13.8 14.05,13.8 14.38,13.47 v1(14.38,13.16)
BAT_GND: length 17.3
  Top Layer w0.102: R6.2 15.16,12.5 v1(15.14,12.48) ; v1(4.09,5.47) 4.09,5.73 4.52,6.15 U2.13
  Bottom Layer w0.102: v1(4.09,5.47) 4.09,6.06 5.26,7.23 5.26,8.11 5.25,8.12 5.25,8.81 9.38,12.93 10.19,12.93 10.29,12.83 10.87,12.83 10.97,12.93 14.08,12.93 14.59,12.43 15.08,12.43 v1(15.14,12.48)
CS: length 26.3
  Top Layer w0.102: v1(18.47,15.68) 18.74,15.41 U9.13 ; U2.21 5.15,8.88 5.15,10.17 v1(4.94,10.37)
  Inner1 w0.102: v1(18.47,15.68) 18.73,15.42 18.73,13.8 17.81,12.88 15.73,12.88 14,14.62 12.59,14.62 12.48,14.51
  Inner2 w0.102: 9.27,14.03 12,14.03 v1(12.48,14.51) ; 9.27,14.03 5.61,10.37 v1(4.94,10.37) ; 9.27,14.03 8.13,14.03 v1(7.85,14.3)
  Bottom Layer w0.102: v1(7.85,14.3) 7.85,14.86 8.74,15.75 9.75,15.75
DACVREF: length 17
  Top Layer w0.203: C17.1 18.94,10.63 18.74,10.83 U9.5
  Top Layer w0.254: U8.1 13.63,19.66 13.54,19.74 v1(13.54,20.05)
  Inner1 w0.203: v1(18.93,10.6) 19.08,10.75 19.08,15.43 v1(19.22,15.57)
  Bottom Layer w0.102: v1(13.54,20.05) 13.89,20.39 14.65,20.39 arc(15.14,20.18) 15.62,19.94 arc(17.04,19.03) 18.3,17.9 arc(18.34,17.86) 18.37,17.83 18.37,16.41 v1(19.22,15.57)
  Bottom Layer w0.203: TP10.1 19.22,15.31 v1(19.22,15.57)
DRDY: length 31.8
  Top Layer w0.102: v1(12.45,11.76) 11.8,12.4 11.8,13.2 11.38,13.62 7.56,13.62 v1(6.87,12.93) ; 3.47,6.46 3.47,5.97 2.89,5.38 v1(2.89,5.25)
  Top Layer w0.152: U9.18 16.35,14.07 v1(16.35,14.63)
  Inner1 w0.102: v1(16.35,14.63) 16.69,14.29 16.69,13.39 16.39,13.09 15.81,13.09 13.9,15 12.44,15 12.1,14.66 12.1,14.35 12.38,14.07 12.57,14.07 12.91,14.41 13.44,14.41 13.7,14.16 13.7,13.9 13.19,13.39 13.19,12.48 12.47,11.76 v1(12.45,11.76)
  Bottom Layer w0.102: TP5.1 12.44,11.75 v1(12.45,11.76) ; v1(2.89,5.25) 3.2,5.56 3.2,6.03 4.64,7.47 4.64,9.06 7.04,11.46 7.04,12.75 v1(6.87,12.93)
NRST: length 12.2
  Top Layer w0.102: U2.24 4.15,9.14 v1(4.15,9.6)
  Bottom Layer w0.102: v1(4.15,9.6) 4.15,9.05 4.17,9.03 4.32,9.03 5.32,10.03 5.32,10.58 4.4,11.5 4.4,13.45 5.86,14.92 6,14.92 6.67,15.58 6.67,16.83 5.75,17.75
NTC_ADC_1: length 17.3
  Top Layer w0.102: 15.16,11.33 R2.2 ; 15.16,11.33 14.92,11.1 14.31,11.1 14.17,11.24 v1(14.17,11.52) ; 15.16,11.33 RT1.1 ; v1(1.92,8.26) 2.04,8.14 U2.3
  Inner2 w0.102: v1(1.92,8.26) 1.92,8.26 4.65,8.26 8.57,12.18 9.77,12.18 10.02,12.43 10.73,12.43 10.83,12.53 11.66,12.53 12.05,12.14 12.6,12.14 12.97,11.77 13.92,11.77 v1(14.17,11.52)
NTC_ADC_2: length 19.8
  Top Layer w0.102: v1(1.32,8.31) 1.84,7.79 2.45,7.79 ; v1(7.88,13.25) 8.05,13.42 10.26,13.42 v1(10.44,13.25) ; 13.89,10.6 13.79,10.7 13.79,10.8 13.64,10.94 v1(13.64,12.45)
  Top Layer w0.152: RT1.2 13.89,10.6
  Inner1 w0.102: v1(1.32,8.31) 1.74,7.88 2.08,7.88 2.09,7.89 2.11,7.89 2.99,8.77 4.27,8.77 7.88,12.37 v1(7.88,13.25)
  Inner2 w0.102: v1(10.44,13.25) 12.84,13.25 12.95,13.14 12.95,13.14 v1(13.64,12.45)
NTC_GND: length 17.9
  Top Layer w0.102: R2.1 14.67,11.62 v1(14.17,12.12) ; U2.2 2.32,8.49 2.17,8.63 1.62,8.63 v1(1.28,8.97)
  Inner2 w0.102: v1(14.17,12.12) 14.02,11.97 13.54,11.97 12.47,13.04 10.76,13.04 10.59,12.87 10.28,12.87 10.22,12.93 9.04,12.93 4.57,8.46 2.6,8.46 2.42,8.64 1.61,8.64 v1(1.28,8.97)
OCDSCK: length 4.3
  Top Layer w0.152: U9.16 17.34,14.24 v1(17.81,14.71)
  Bottom Layer w0.152: v1(17.81,14.71) 17.46,15.07 15.88,15.07 15.32,14.51 15.32,13.93 TP12.1
OCDSDA: length 2.7
  Top Layer w0.152: v1(17.06,14.61) 16.94,14.5 U9.17
  Bottom Layer w0.152: TP13.1 17.06,12.5 v1(17.06,14.61)
OP1N/WE: length 10.2
  Top Layer w0.203: R3.2 20.12,9.23 C18.2 20.12,8.23 19.91,8.03 ; U9.24 16.51,10.27 16.98,9.8 19.59,9.8 19.96,9.43 19.97,9.43 ; 19.91,8.03 19.8,7.91 v1(19.8,7.64) ; 19.91,8.03 18.18,8.03 17.59,8.62 U11.4
  Bottom Layer w0.203: v1(19.8,7.64) 19.48,7.32 TP6.1
OP1O: length 8.2
  Top Layer w0.203: U9.23 16.16,11.69 15.93,11.46 15.93,10.39 16.9,9.43 18.2,9.43 ; 18.2,9.43 18.2,8.96 v1(18.53,8.63) ; 18.2,9.43 19.11,9.43 ; R3.1 19.16,8.83 19.57,8.41
  Bottom Layer w0.203: v1(18.53,8.63) 18.53,9.06 TP8.1
OP3N/RE: length 4.6
  Top Layer w0.203: U9.3 17.88,11.07 v1(17.88,10.56)
  Top Layer w0.254: U11.3 16.08,8.82 v1(16.69,8.82)
  Bottom Layer w0.203: v1(17.88,10.56) 17.47,10.56 16.69,9.78 ; 16.69,9.78 v1(16.69,8.82) ; 16.69,9.78 16.07,10.4
OP3O/CE: length 13.6
  Top Layer w0.203: U9.2 17.34,10.36 17.59,10.11 20.23,10.11 20.51,9.83 20.51,8.11 20.25,7.85 20.25,7.35 19.34,6.44 19.34,5.9 17.54,4.11 U11.1 17.26,3.82 16.65,3.22 v1(16.55,3.22)
  Bottom Layer w0.203: 15.61,3.19 v1(16.55,3.22)
RF_IO: length 0.8
  Top Layer w0.203: 4.86,5.59 4.87,5.61 U2.14
RX_TEST: length 17.6
  Top Layer w0.102: v1(2.83,5.85) 3.12,6.15 3.12,6.46
  Inner1 w0.102: v1(10.9,17.73) 10.38,17.73 9.05,16.4 9.05,12.39 5.03,8.38 5.03,7.28 4.03,6.28 3.36,6.28 2.91,5.82 2.83,5.82 v1(2.83,5.85)
  Bottom Layer w0.102: 11.75,17.75 11.73,17.73 v1(10.9,17.73)
SCLK: length 25.9
  Top Layer w0.102: v1(1.46,7.59) 1.46,7.39 1.82,7.03 2.45,7.03 U2.6 ; v1(19.79,13.13) 19.74,13.09 U9.10
  Inner1 w0.102: v1(13.29,14.04) 12.83,13.58 12.83,12.48 12.53,12.17 11.01,12.17 v1(10.92,12.08)
  Inner2 w0.102: v1(1.46,7.59) 1.6,7.59 1.81,7.8 2.11,7.8 2.36,8.05 3.15,8.05 3.15,8.06 ; v1(19.79,13.13) 19.74,13.09 15.46,13.09 14.51,14.04 v1(13.29,14.04) ; v1(10.92,12.08) 10.88,12.12 10.14,12.12 9.96,11.94 8.62,11.94 4.73,8.05 3.15,8.05
  Bottom Layer w0.102: TP1.1 12.06,13.44 12.37,13.44 12.97,14.04 v1(13.29,14.04)
SDI_RX: length 26.4
  Top Layer w0.102: v1(2.06,7.41) 2.08,7.43 2.44,7.43 2.45,7.44 ; v1(19.71,13.85) 19.34,13.49 U9.11
  Inner1 w0.102: v1(2.06,7.41) 2.06,7.54 3.09,8.57 4.36,8.57 8.37,12.57 8.37,14.64 v1(8.26,14.74)
  Inner2 w0.102: v1(19.71,13.85) 19.15,13.29 15.54,13.29 13.95,14.88 11.93,14.88 v1(11.67,14.63) 11.28,14.23 8.78,14.23 v1(8.26,14.74)
  Bottom Layer w0.102: v1(8.26,14.74) 8.76,14.74 9.75,13.75
SDO_TX: length 29.6
  Top Layer w0.102: v1(19.65,14.5) 19.65,14.39 U9.12 ; 2.72,9.16 2.71,9.14 1.97,9.14 1.73,9.38 v1(1.73,9.59)
  Inner2 w0.102: v1(19.65,14.5) 20.17,13.98 20.17,12.86 20.07,12.76 16.01,12.76 15.32,12.07 14.94,12.07 v1(13.67,13.34) 13.03,13.34 12.75,13.62 9.44,13.62 4.48,8.67 2.68,8.67 2.22,9.12 1.99,9.12 1.73,9.38 v1(1.73,9.59)
  Bottom Layer w0.102: v1(13.67,13.34) 13.67,14.66 12.58,15.75 11.75,15.75
SWCK: length 15.6
  Top Layer w0.102: v1(1.91,6.66) 1.99,6.74 U2.7
  Inner1 w0.102: v1(1.91,6.66) 1.91,6.7 2.52,7.31 2.52,7.71 3.17,8.36 4.44,8.36 8.64,12.56 8.64,16.85 v1(8.38,17.1)
  Bottom Layer w0.102: 7.75,17.75 8.38,17.12 v1(8.38,17.1)
SWD: length 16.3
  Top Layer w0.102: v1(2.19,6.09) 2.45,6.09 U2.8
  Inner1 w0.102: v1(2.19,6.09) 2.19,6.32 2.72,6.85 2.72,7.63 3.26,8.16 4.53,8.16 8.84,12.48 8.84,16.91 v1(9.09,17.16)
  Bottom Layer w0.102: v1(9.09,17.16) 9.16,17.16 9.75,17.75
TX_LOG: length 15.3
  Top Layer w0.102: 3.82,6.46 3.82,6.03 3.41,5.62 3.41,5.24 3.18,5 v1(3.18,4.68)
  Bottom Layer w0.102: 7.75,15.75 6.88,14.87 6.88,13.61 7.25,13.24 7.25,11.38 4.85,8.98 4.85,7.39 3.41,5.94 3.41,5.2 3.18,4.97 v1(3.18,4.68)
V_RET: length 13.5
  Top Layer w0.102: 13.4,10.6 13.4,12.15 13.01,12.55 v1(12.31,12.55) ; 5.92,7.37 5.88,7.41 v1(5.68,7.41) 5.17,7.41 U2.17
  Inner2 w0.102: v1(12.31,12.55) 12.01,12.84 10.85,12.84 10.68,12.67 9.73,12.67 9.62,12.56
  Bottom Layer w0.102: v1(9.62,12.56) 9.29,12.56 5.68,8.95 v1(5.68,7.41)
$1N117316: length 4.4
  Top Layer w0.102: U2.19 5.49,8.14 5.73,8.37 5.73,9.17 5.61,9.29 5.61,11.53 5.22,11.91
$1N117351: length 9.6
  Top Layer w0.102: C7.2 6.36,8.09 6.36,6.23 6.15,6.03 5.75,6.03 5.54,6.23 5.54,6.91 5.37,7.09 U2.16 ; C7.2 6.24,8.19 5.93,8.49 5.93,9.67 6.17,9.9 C9.2 6.62,11.22 6.62,11.91 ; C7.2 6.25,8.17 5.87,7.79 U2.18
$1N176146: length 2.9
  Top Layer w0.203: U9.19 16.1,13.49 15.9,13.69 15.9,15.71 15.68,15.93
$1N182514: length 3.2
  Top Layer w0.152: C24.2 7.17,2.12 7.05,2 v1(7.05,1.68)
  Top Layer w0.305: C5.1 7.17,2.12 L2.2
  Bottom Layer w0.381: TP24.1 7.24,1.87 v1(7.05,1.68)
$1N182522: length 1.1
  Top Layer w0.305: U3.2 11.78,0.95 C20.2
$1N182523: length 1.7
  Top Layer w0.305: L2.1 C2.2 arc(4.94,4.56) C19.2

## Copper pours and planes (outline as drawn; the poured copper is in the pictures)
GND on Top Layer: outline of 112 points within -1.15,-1.35 23.15,22.95
GND on Top Layer: outline of 112 points within -1.15,-1.43 23.15,22.87
GND on Bottom Layer: outline of 112 points within -1.76,-1.35 22.54,22.95
GND on Bottom Layer: outline of 112 points within -1.55,-1.5 22.75,22.8
GND on Inner1: outline of 112 points within -1.5,-1.5 22.8,22.8
GND on Inner1: outline of 112 points within -1.5,-1.5 22.8,22.8
GND on Inner2: outline of 112 points within -1.4,-1.15 22.9,23.15
GND on Inner2: outline of 112 points within -1.4,-1.15 22.9,23.15
VDD on Inner1: 12.38,16.74 16.19,16.74 16.59,16.34 16.59,15.55 16.52,15.47 16.34,15.47 16.24,15.58 16.24,15.73 16.08,15.88 15.62,15.88 15.37,16.14 12.43,16.14 12.27,16.29 12.27,16.64

Small or netless copper shapes (teardrops, artwork), in the pictures only: 167 on Top Layer, 51 on Bottom Layer, 18 on Inner1, 27 on Inner2

## Text on the board
Bottom Assembly Layer: VBAT | GND | NRST | TX_T | SWCK | CS | SID_RX | SWD | DRDY | SCLK | RX_T | SDO_TX | VDD | LATCH | OCDSCK | OP3N/RE | OP3O/CE | OCDSDA | DACVREF | OP1O | OP1N/WE
Bottom Silkscreen Layer: 1.5V CGM / BH66F2452 / HT32F67595 | BMHB2017-DB | V1.0
Component Marking Layer: U2 | U9
Top Silkscreen Layer: RE | CE | WE | SR716-1.5V | CGM | + | -
